# Altium project Plata_2.PrjPcb
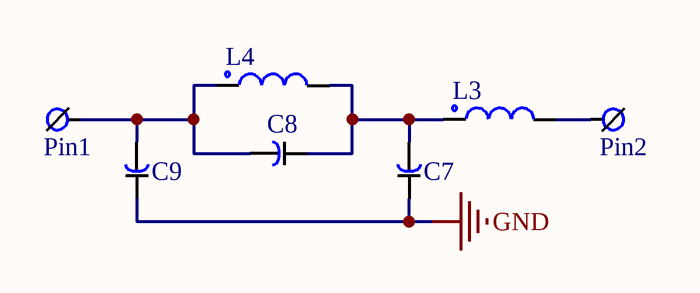
[diagram p0: Sheet2.SchDoc]
1 sheet, 7 parts. Net scope: global (net labels, ports and power ports of the same name join across sheets).
Board file: Plata_2.PcbDoc

## Sheet Sheet2.SchDoc
size A4

### Parts
C7  C7  [C7(1206)]  (value not drawn)
C8  C8  [C8(1812)]  (value not drawn)
C9  C9  [C9(1812)]  (value not drawn)
L3  L  [L3,L4]  (value not drawn)
L4  L  [L3,L4]  (value not drawn)
Pin1  Pin  [Pin]  (value not drawn)
Pin2  Pin  [Pin]  (value not drawn)

### Nets
GND: C7.2 C9.2
NetC7_1: C7.1 C8.2 L3.1 L4.2
NetC8_1: C8.1 C9.1 L4.1 Pin1.1
NetL3_2: L3.2 Pin2.1